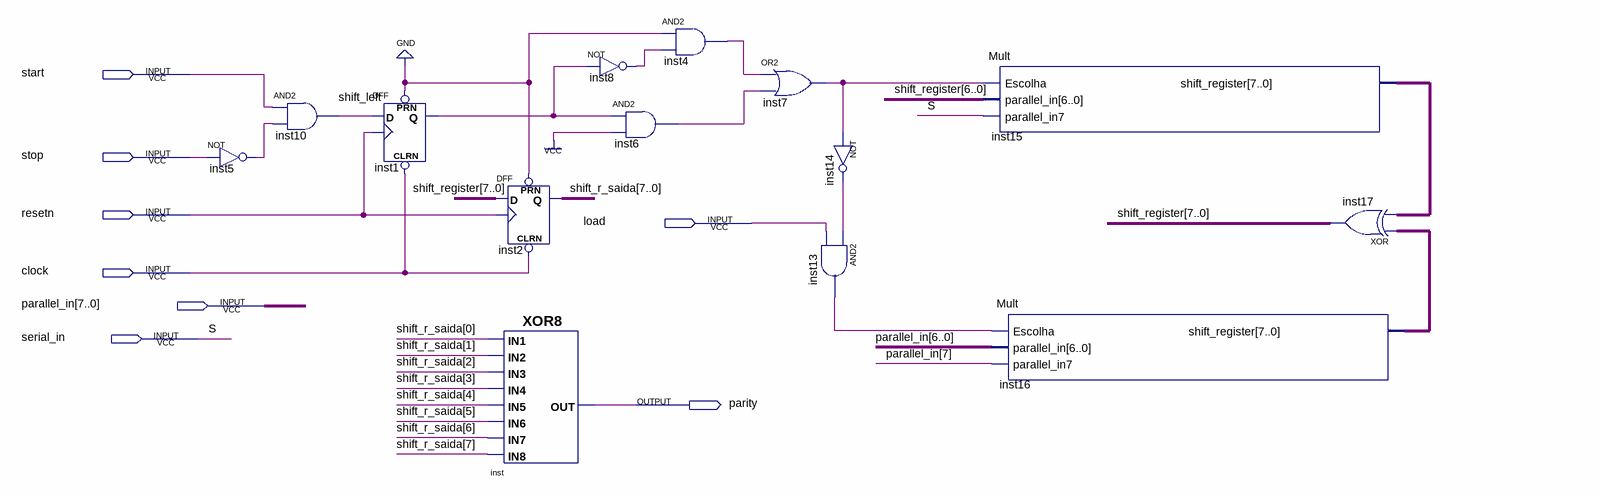
[diagram p0: schematic sheet]
// Quartus schematic Questao04.bdf as structural Verilog: 14 symbols, 8 pins
module Questao04 (
  input  start,
  input  stop,
  input  resetn,
  input  load,
  input  clock,
  input  [7:0] parallel_in,
  input  serial_in,
  output parity
);

  wire inst1_q, inst4_out, inst5_out, inst6_out, inst7_out, inst8_out, inst13_out, inst14_out, shift_left;
  wire [7:0] inst15_shift_register, inst16_shift_register, shift_r_saida, shift_register;

  not inst5 (inst5_out, stop);
  and inst10 (shift_left, start, inst5_out);
  DFF inst1 (.CLRN(clock), .CLK(resetn), .D(shift_left), .PRN(1'b0), .Q(inst1_q));
  DFF inst2[7:0] (.CLRN(clock), .CLK(resetn), .D(shift_register), .PRN(1'b0), .Q(shift_r_saida));
  XOR8 inst (
    .IN8(shift_r_saida[7]), .IN1(shift_r_saida[0]), .IN7(shift_r_saida[6]), .IN6(shift_r_saida[5]),
    .IN5(shift_r_saida[4]), .IN4(shift_r_saida[3]), .IN3(shift_r_saida[2]), .IN2(shift_r_saida[1]),
    .OUT(parity));
  not inst8 (inst8_out, inst1_q);
  and inst4 (inst4_out, 1'b0, inst8_out);
  and inst6 (inst6_out, inst1_q, 1'b1);
  or inst7 (inst7_out, inst4_out, inst6_out);
  not inst14 (inst14_out, inst7_out);
  and inst13 (inst13_out, inst14_out, load);
  Mult inst15 (
    .Escolha(inst7_out), .parallel_in(shift_register[6:0]), .parallel_in7(serial_in),
    .shift_register(inst15_shift_register));
  Mult inst16 (
    .Escolha(inst13_out), .parallel_in(parallel_in[6:0]), .parallel_in7(parallel_in[7]),
    .shift_register(inst16_shift_register));
  assign shift_register = inst16_shift_register ^ inst15_shift_register;  // XOR inst17, 8 bits wide

  // Other names for the same wires on the sheet: S = serial_in
endmodule
